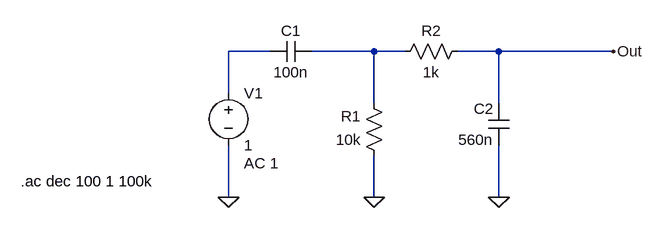
[diagram p0: schematic BandPasFilter.asc]
BandPasFilter.asc, the LTspice schematic file:
Version 4.1
SHEET 1 880 680
WIRE -32 144 -96 144
WIRE 128 144 32 144
WIRE 176 144 128 144
WIRE 320 144 256 144
WIRE 496 144 320 144
WIRE -96 208 -96 144
WIRE 128 224 128 144
WIRE 320 224 320 144
WIRE -96 368 -96 288
WIRE 128 368 128 304
WIRE 320 368 320 288
FLAG -96 368 0
FLAG 496 144 Out
FLAG 128 368 0
FLAG 320 368 0
SYMBOL res 144 320 R180
WINDOW 0 36 76 Left 2
WINDOW 3 36 40 Left 2
SYMATTR InstName R1
SYMATTR Value 10k
SYMBOL voltage -96 192 R0
WINDOW 123 24 124 Left 2
WINDOW 39 0 0 Left 0
SYMATTR Value2 AC 1
SYMATTR InstName V1
SYMATTR Value 1
SYMBOL cap 32 128 R90
WINDOW 0 0 32 VBottom 2
WINDOW 3 32 32 VTop 2
SYMATTR InstName C1
SYMATTR Value 100n
SYMBOL cap 336 288 R180
WINDOW 0 24 56 Left 2
WINDOW 3 24 8 Left 2
SYMATTR InstName C2
SYMATTR Value 560n
SYMBOL res 160 160 R270
WINDOW 0 32 56 VTop 2
WINDOW 3 0 56 VBottom 2
SYMATTR InstName R2
SYMATTR Value 1k
TEXT -416 344 Left 2 !.ac dec 100 1 100k

The netlist it stands for:
* BandPasFilter.asc
R1 0 N002 10k
V1 N001 0 1 AC 1
C1 N002 N001 100n
C2 0 Out 560n
R2 N002 Out 1k
.ac dec 100 1 100k
.backanno
.end